# Altium schematic sheet DASHCAM_V2.0E - Cover and Revisions.SchDoc
size A3; Email: eliofagundez07@gmail.com; DrawnBy: UKAYACIK; Engineer: UKAYACIK; DocumentNumber: 1; Revision: A; SheetNumber: 1; SheetTotal: 21; Sheet Title: Cover Page
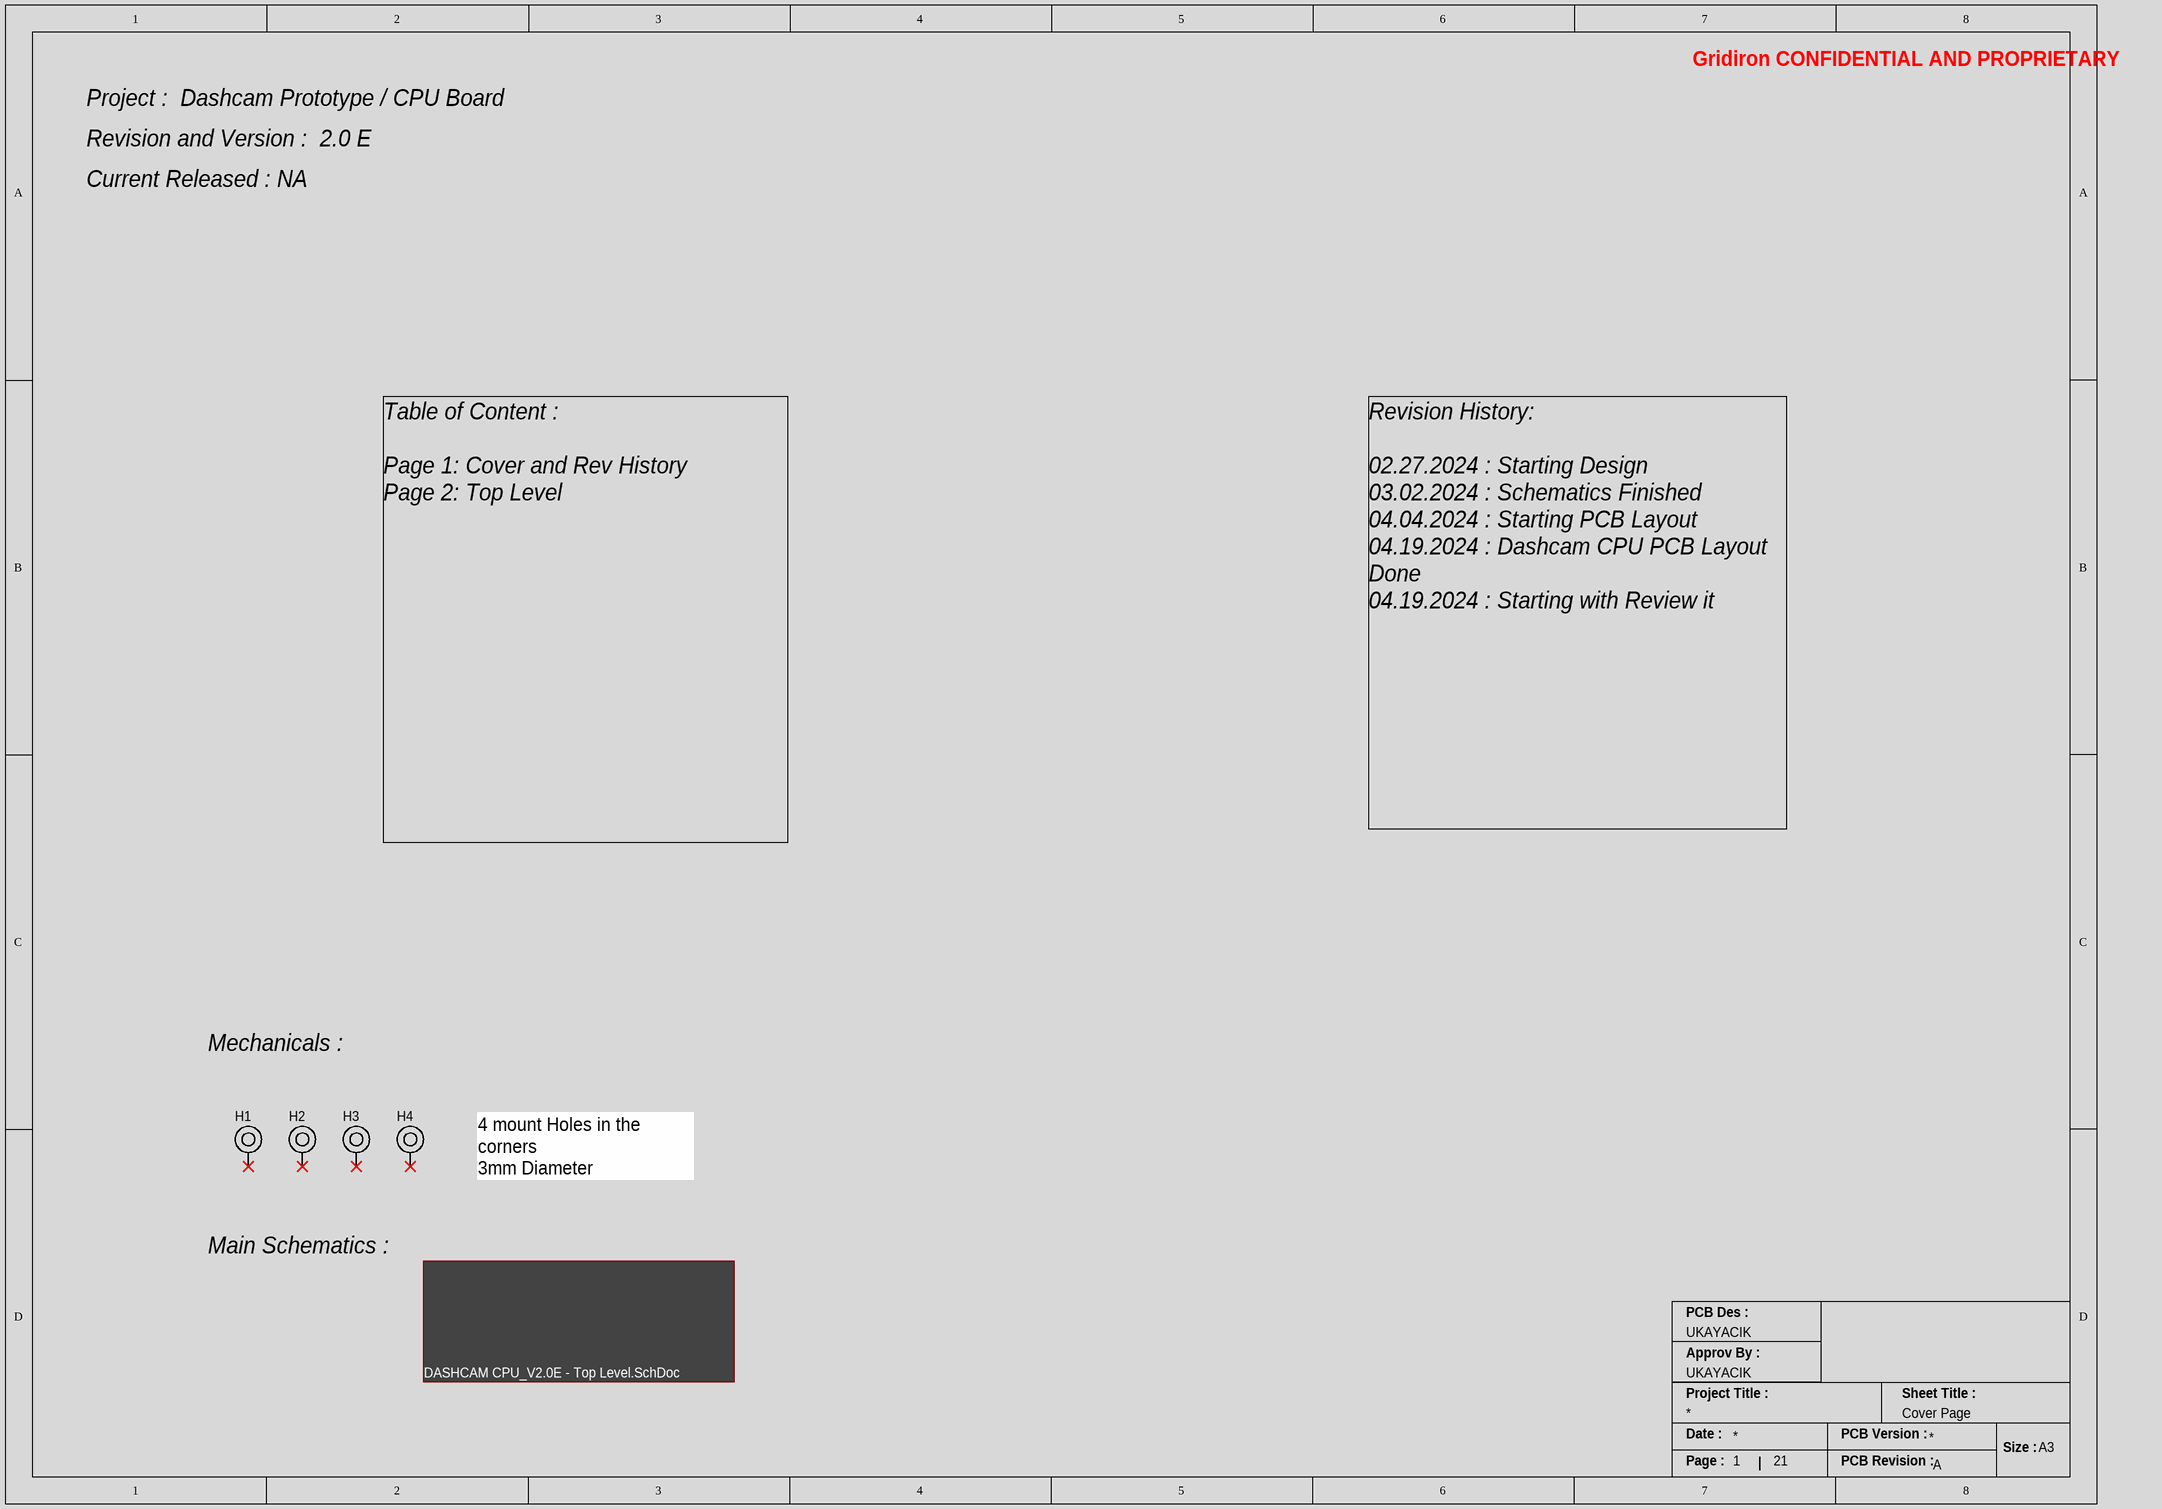
[diagram p0: DASHCAM_V2.0E - Cover and Revisions.SchDoc]

## Parts
H1  Mounting Hole  [PTH_3.2X5]  (value not drawn)  (no BOM)
H2  Mounting Hole  [PTH_3.2X5]  (value not drawn)  (no BOM)
H3  Mounting Hole  [PTH_3.2X5]  (value not drawn)  (no BOM)
H4  Mounting Hole  [PTH_3.2X5]  (value not drawn)  (no BOM)

## Sub-sheets
U_DASHCAM CPU_V2.0E - Top Level = DASHCAM CPU_V2.0E - Top Level.SchDoc: no entries

## Nets

Not connected (* = marked no-connect by the designer): H1 1*; H2 1*; H3 1*; H4 1*

## Notes on the sheet
- Project :  Dashcam Prototype / CPU Board
- Gridiron CONFIDENTIAL AND PROPRIETARY
- Revision and Version :  2.0 E
- Current Released : NA
- Table of Content :
  Page 1: Cover and Rev History
  Page 2: Top Level
- Revision History:
  02.27.2024 : Starting Design
  03.02.2024 : Schematics Finished
  04.04.2024 : Starting PCB Layout
  04.19.2024 : Dashcam CPU PCB Layout Done
  04.19.2024 : Starting with Review it
- Mechanicals :
- 4 mount Holes in the corners
  3mm Diameter
- Main Schematics :
- PCB Des :
- Approv By :
- Project Title :
- Sheet Title :
- Date :
- PCB Version :
- Size :
- A3
- Page :
- PCB Revision :

## Library data of the parts
H1-H4 = MECHANICALS_MOUNT_PTH: Mounting Hole, Plated